# Altium schematic sheet MSP430F149.SCHDOC
size A4; Organization: UNSW Solar Racing Team; Address3: UNSW; Address4: Sydney NSW 2052; Address2: Electrical Engineering; Address1: Rm 109
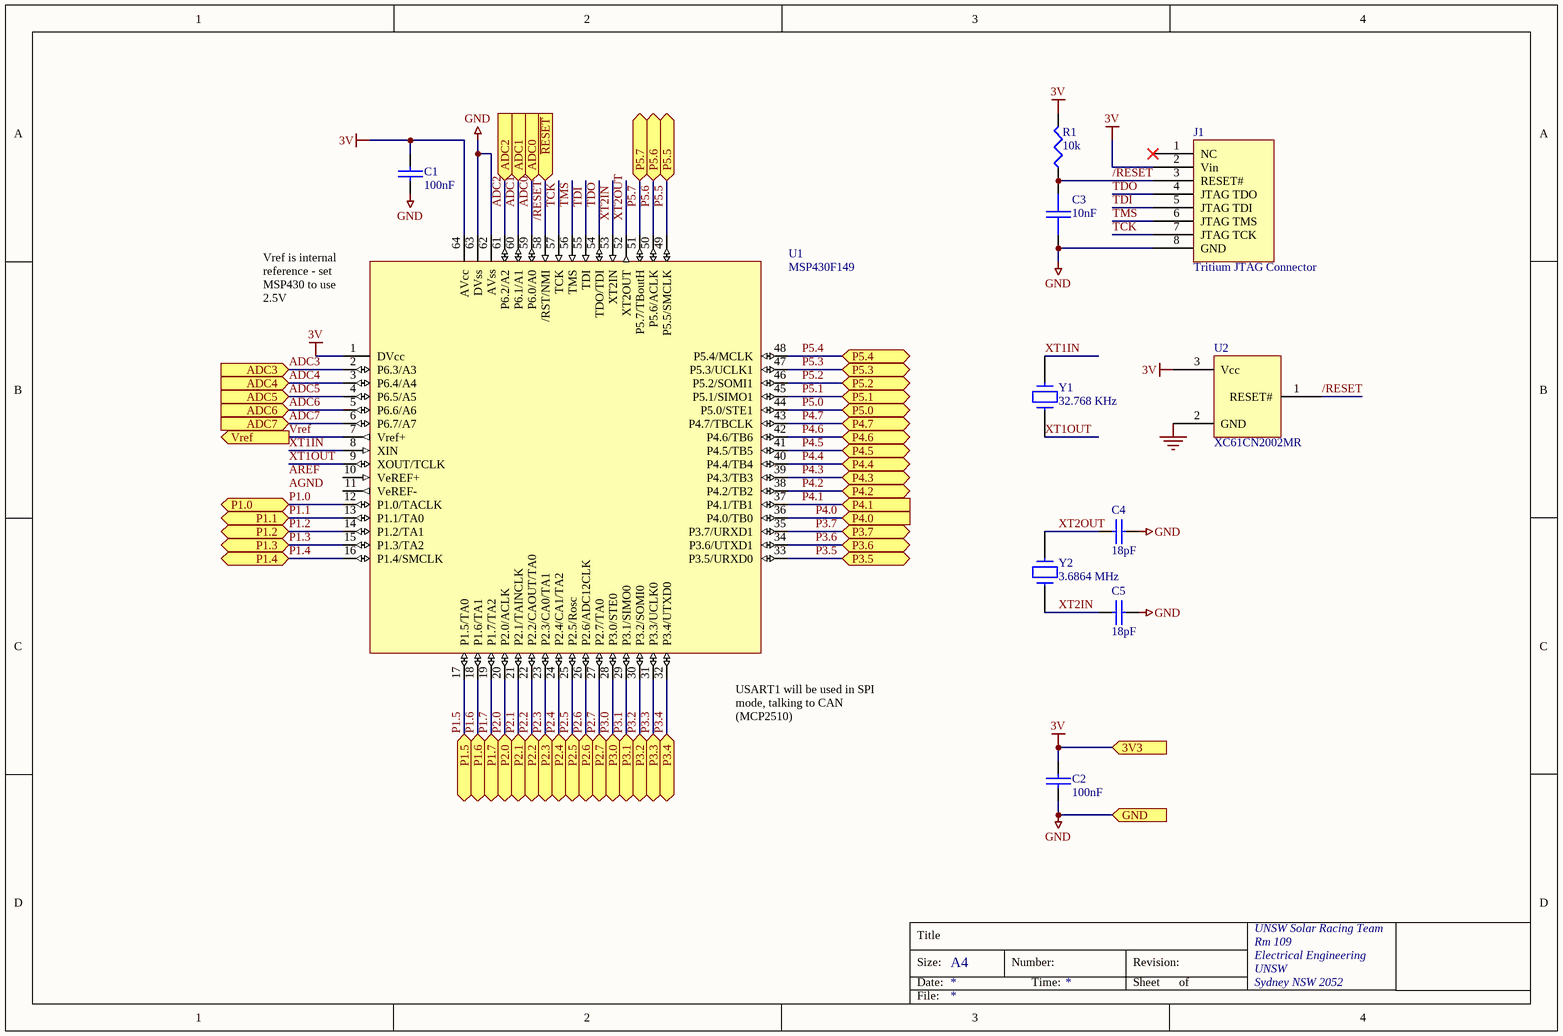
[diagram p0: MSP430F149.SCHDOC]

## Parts
C1  100nF  [1608[0603]]
C2  100nF  [1608[0603]]
C3  10nF  [1608[0603]]
C4  18pF  [1608[0603]]
C5  18pF  [1608[0603]]
J1  Tritium JTAG Connector  [IDC8]
R1  10k  [1608[0603]]
U1  MSP430F149  [QFP64]
U2  XC61CN2002MR  [SOT23]
Y1  32.768 KHz  [WATCHA]
Y2  3.6864 MHz  [HC49/4H]

## Ports
3V3, ADC0 (in), ADC1 (in), ADC2 (in), ADC3 (in), ADC4 (in), ADC5 (in), ADC6 (in), ADC7 (in), GND, P1.0, P1.1, P1.2, P1.3, P1.4, P1.5, P1.6, P1.7, P2.0, P2.1, P2.2, P2.3, P2.4, P2.5, P2.6, P2.7, P3.0, P3.1, P3.2, P3.3, P3.4, P3.5, P3.6, P3.7, P4.0 (in), P4.1 (in), P4.2, P4.3, P4.4, P4.5, P4.6, P4.7, P5.0, P5.1, P5.2, P5.3, P5.4, P5.5, P5.6, P5.7, Vref (out), ~{RESET} (in)

## Nets
3V: C1.1 C2.1 J1.2(Vin) R1.2 U1.1(DVcc) U1.64(AVcc) U2.3(Vcc) ; port 3V3
GND: C1.2 C2.2 C3.2 C4.2 C5.2 J1.8(GND) U1.62(AVss) U1.63(DVss) U2.2(GND) ; port GND
/RESET: C3.1 J1.3(RESET#) R1.1 U1.58(/RST/NMI) U2.1(RESET#) ; port ~{RESET}
ADC0: U1.59(P6.0/A0) ; port ADC0
ADC1: U1.60(P6.1/A1) ; port ADC1
ADC2: U1.61(P6.2/A2) ; port ADC2
ADC3: U1.2(P6.3/A3) ; port ADC3
ADC4: U1.3(P6.4/A4) ; port ADC4
ADC5: U1.4(P6.5/A5) ; port ADC5
ADC6: U1.5(P6.6/A6) ; port ADC6
ADC7: U1.6(P6.7/A7) ; port ADC7
P1.0: U1.12(P1.0/TACLK) ; port P1.0
P1.1: U1.13(P1.1/TA0) ; port P1.1
P1.2: U1.14(P1.2/TA1) ; port P1.2
P1.3: U1.15(P1.3/TA2) ; port P1.3
P1.4: U1.16(P1.4/SMCLK) ; port P1.4
P1.5: U1.17(P1.5/TA0) ; port P1.5
P1.6: U1.18(P1.6/TA1) ; port P1.6
P1.7: U1.19(P1.7/TA2) ; port P1.7
P2.0: U1.20(P2.0/ACLK) ; port P2.0
P2.1: U1.21(P2.1/TAINCLK) ; port P2.1
P2.2: U1.22(P2.2/CAOUT/TA0) ; port P2.2
P2.3: U1.23(P2.3/CA0/TA1) ; port P2.3
P2.4: U1.24(P2.4/CA1/TA2) ; port P2.4
P2.5: U1.25(P2.5/Rosc) ; port P2.5
P2.6: U1.26(P2.6/ADC12CLK) ; port P2.6
P2.7: U1.27(P2.7/TA0) ; port P2.7
P3.0: U1.28(P3.0/STE0) ; port P3.0
P3.1: U1.29(P3.1/SIMO0) ; port P3.1
P3.2: U1.30(P3.2/SOMI0) ; port P3.2
P3.3: U1.31(P3.3/UCLK0) ; port P3.3
P3.4: U1.32(P3.4/UTXD0) ; port P3.4
P3.5: U1.33(P3.5/URXD0) ; port P3.5
P3.6: U1.34(P3.6/UTXD1) ; port P3.6
P3.7: U1.35(P3.7/URXD1) ; port P3.7
P4.0: U1.36(P4.0/TB0) ; port P4.0
P4.1: U1.37(P4.1/TB1) ; port P4.1
P4.2: U1.38(P4.2/TB2) ; port P4.2
P4.3: U1.39(P4.3/TB3) ; port P4.3
P4.4: U1.40(P4.4/TB4) ; port P4.4
P4.5: U1.41(P4.5/TB5) ; port P4.5
P4.6: U1.42(P4.6/TB6) ; port P4.6
P4.7: U1.43(P4.7/TBCLK) ; port P4.7
P5.0: U1.44(P5.0/STE1) ; port P5.0
P5.1: U1.45(P5.1/SIMO1) ; port P5.1
P5.2: U1.46(P5.2/SOMI1) ; port P5.2
P5.3: U1.47(P5.3/UCLK1) ; port P5.3
P5.4: U1.48(P5.4/MCLK) ; port P5.4
P5.5: U1.49(P5.5/SMCLK) ; port P5.5
P5.6: U1.50(P5.6/ACLK) ; port P5.6
P5.7: U1.51(P5.7/TBoutH) ; port P5.7
TCK: J1.7(JTAG_TCK) U1.57(TCK)
TDI: J1.5(JTAG_TDI) U1.55(TDI)
TDO: J1.4(JTAG_TDO) U1.54(TDO/TDI)
TMS: J1.6(JTAG_TMS) U1.56(TMS)
Vref: U1.7(Vref+) ; port Vref
XT1IN: U1.8(XIN) Y1.2
XT1OUT: U1.9(XOUT/TCLK) Y1.1
XT2IN: C5.1 U1.53(XT2IN) Y2.1
XT2OUT: C4.1 U1.52(XT2OUT) Y2.2

Not connected (* = marked no-connect by the designer): J1 1(NC)*; U1 10(VeREF+) 11(VeREF-)

## Notes on the sheet
- (near U1) Vref is internal reference - set MSP430 to use 2.5V
- (near U1) USART1 will be used in SPI mode, talking to CAN (MCP2510)
- Labels drawn without touching a wire or pin: AGND, AREF
- Title
- Size:
- Date:
- A4
- Number:
- Time:
- Revision:
- Sheet
- of
- File:

## Library data of the parts
C1-C5 = CAP: Capacitor
  C1 C2: Farnell: 753-567; Price: 0.31
  C3: Farnell: 722-236; Price: 0.15
  C4 C5: Farnell: 721-992; Price: 0.11
J1 = 430F_JTAG_TRITIUM: Tritium JTAG interface for MSP430; Farnell: 511-808; Price: 1.32
R1 = RES1: Resistor; Farnell: 612-601; Price: 0.11
U1 = MSP430F14X: Farnell: NA
U2 = XC61F: SOT23 reset generator; Farnell: NA
Y1 Y2 = CRYSTAL
  Y1: Farnell: 103-868
  Y2: Farnell: 485-111; Price: 3.38